# Altium schematic sheet main.SchDoc
size A3; SheetNumber: 1; SheetTotal: 1
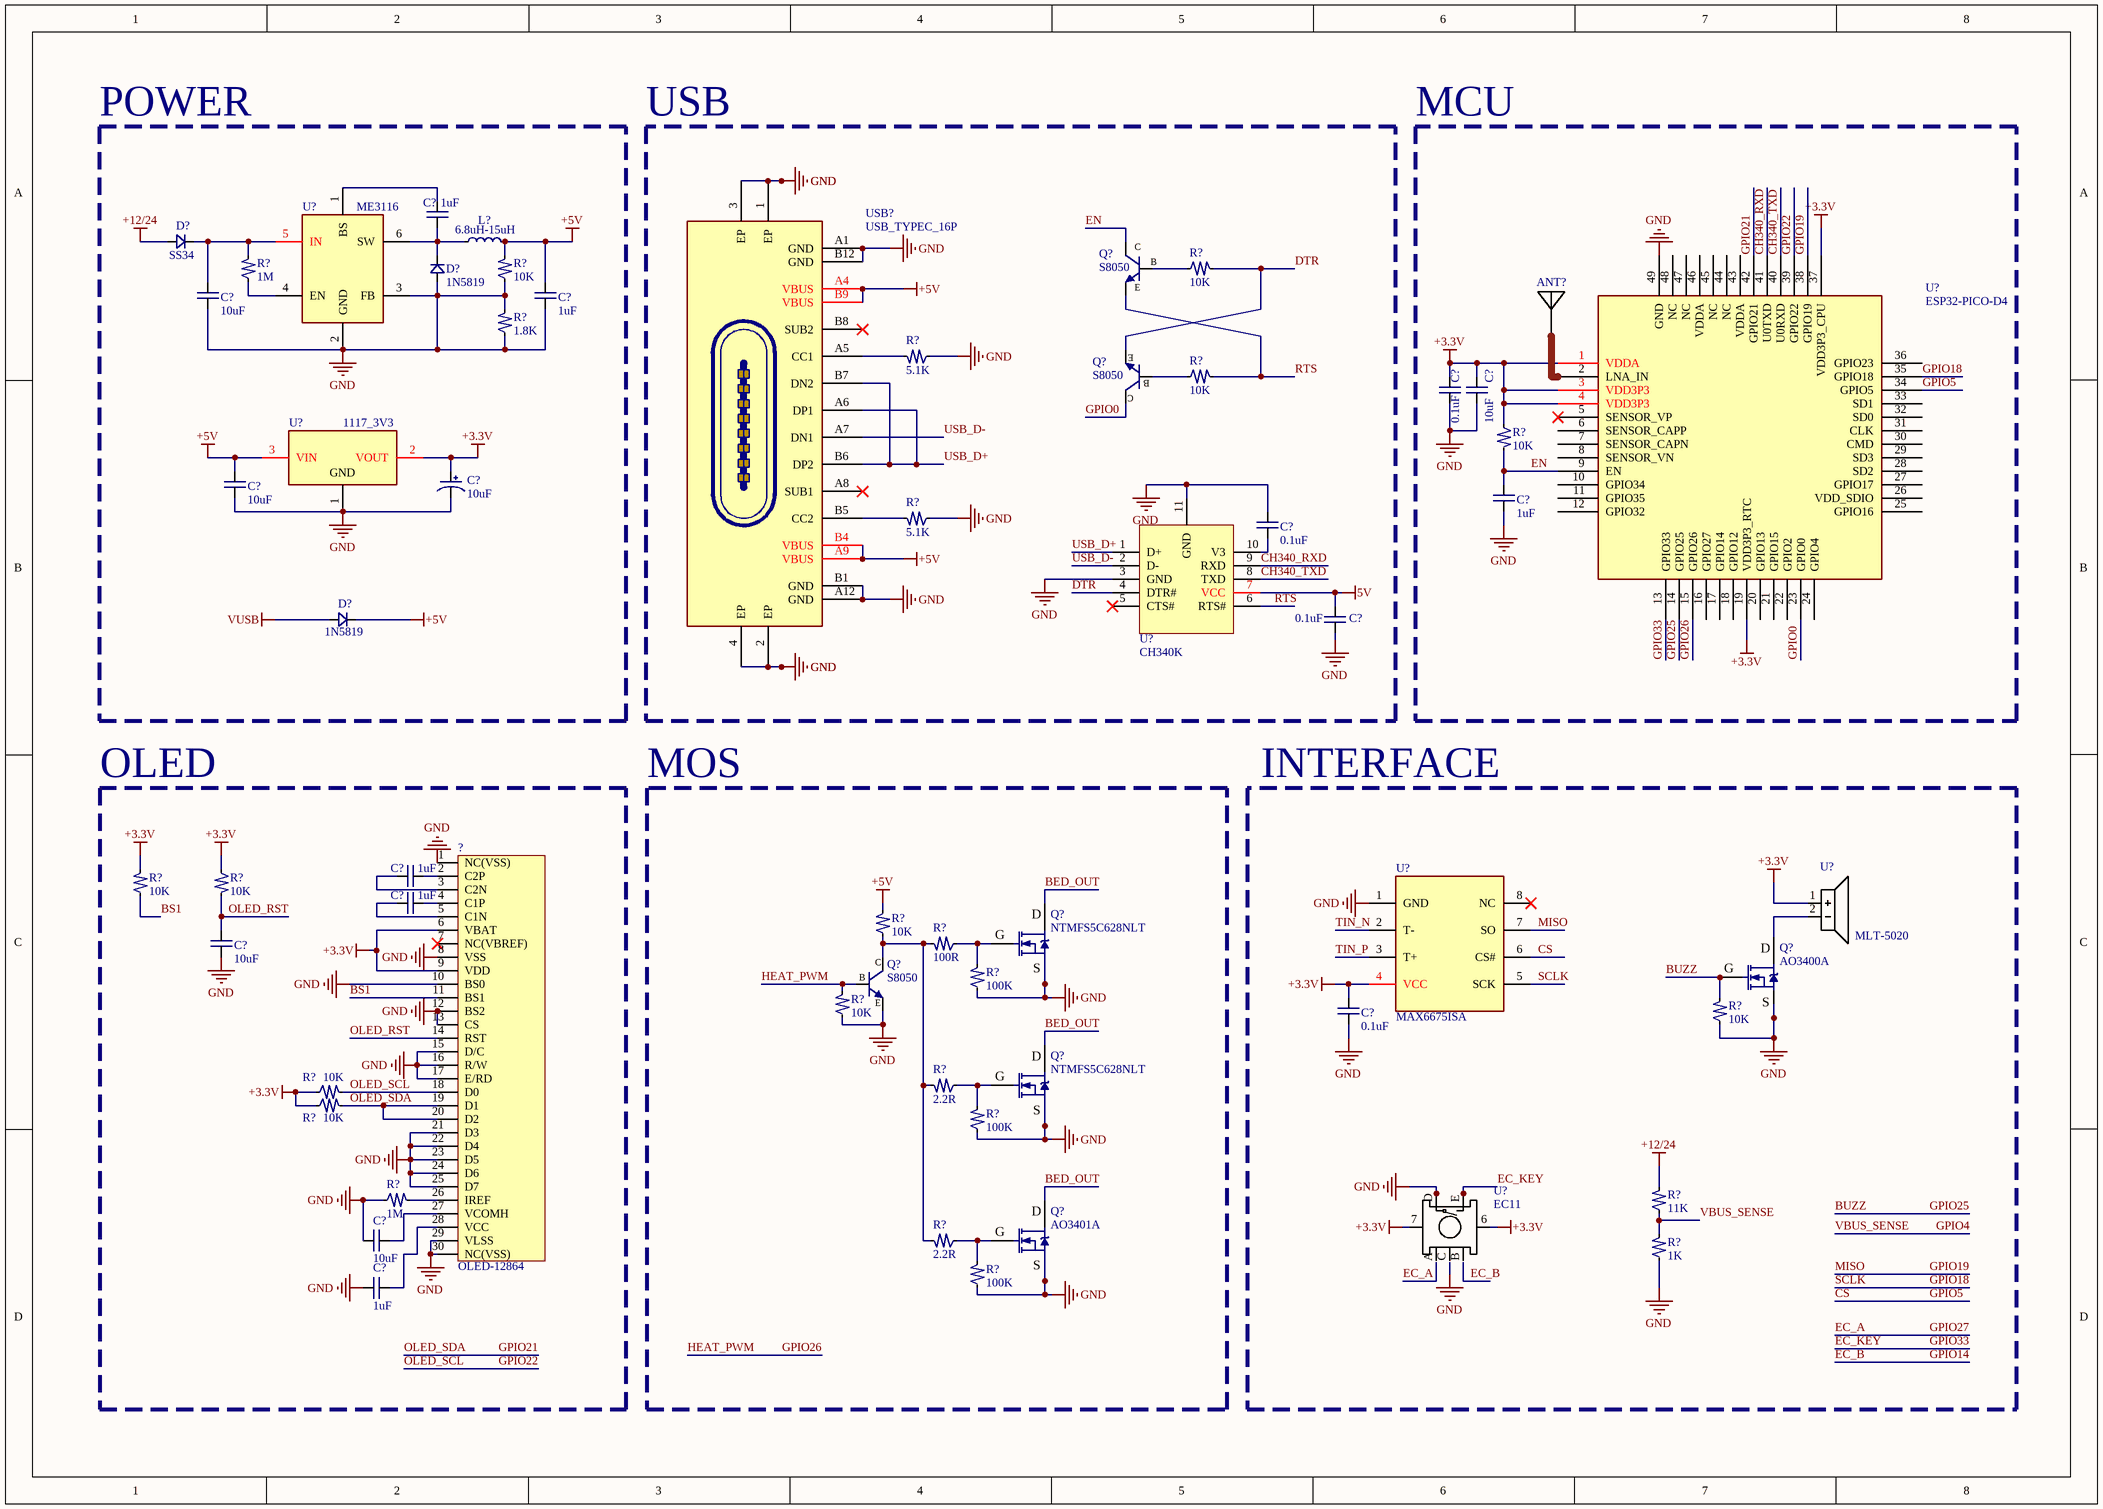
[diagram p0: main.SchDoc]

## Parts
(Parts that share a designator on the sheet are numbered #1, #2 ... from top to bottom, then left to right.)
?  OLED-12864  [OLED-12864-1.3-TOP]
ANT?  ANT  [CrossAir_CAC03]  (value not drawn)
C?#1  1uF
C?#2  10uF
C?#3  1uF
C?#4  0.1uF  [C_0603]
C?#5  10uF  [C_0603]
C?#6  10uF
C?#7  10uF  [CASE-A-3216]
C?#8  1uF  [C_0402]
C?#9  0.1uF  [C_0603]
C?#10  0.1uF  [C_0603]
C?#11  1uF
C?#12  1uF
C?#13  10uF
C?#14  0.1uF  [C_0603]
C?#15  10uF
C?#16  1uF
D?#1  SS34  [SMA(DO-214AC)]
D?#2  1N5819  [SMA(DO-214AC)]
D?#3  1N5819  [SMA(DO-214AC)]
L?  6.8uH-15uH
Q?#1  S8050  [SOT-23-3]
Q?#2  S8050  [SOT-23-3]
Q?#3  NTMFS5C628NLT
Q?#4  AO3400A
Q?#5  S8050  [SOT-23-3]
Q?#6  NTMFS5C628NLT
Q?#7  AO3401A
R?#1  1M  [R 0402_L]
R?#2  10K  [R 0402_L]
R?#3  10K  [R_0603]
R?#4  1.8K  [R 0402_L]
R?#5  5.1K  [R 0402_L]
R?#6  10K  [R_0603]
R?#7  10K  [R_0402]
R?#8  5.1K  [R 0402_L]
R?#9  10K  [R 0402_L]
R?#10  10K  [R 0402_L]
R?#11  10K  [R 0402_L]
R?#12  100R  [R 0402_L]
R?#13  100K  [R 0402_L]
R?#14  10K  [R 0402_L]
R?#15  10K  [R 0402_L]
R?#16  2.2R  [R 0402_L]
R?#17  10K  [R 0402_L]
R?#18  10K  [R 0402_L]
R?#19  100K  [R 0402_L]
R?#20  1M  [R 0402_L]
R?#21  11K  [R 0402_L]
R?#22  2.2R  [R 0402_L]
R?#23  1K  [R 0402_L]
R?#24  100K  [R 0402_L]
U?#1  ME3116
U?#2  ESP32-PICO-D4
U?#3  1117_3V3  [SOT-223]
U?#4  CH340K  [ESOP-10]
U?#5  MLT-5020
U?#6  MAX6675ISA
U?#7  EC11
USB?  USB_TYPEC_16P

## Blocks framed on the sheet
POWER: C?#1-C?#3 C?#6 C?#7 D?#1-D?#3 L? R?#1 R?#2 R?#4 U?#1 U?#3
USB: C?#9 C?#10 Q?#1 Q?#2 R?#3 R?#5 R?#6 R?#8 U?#4 USB?
MCU: ANT? C?#4 C?#5 C?#8 R?#7 U?#2
OLED: ? C?#11-C?#13 C?#15 C?#16 R?#9 R?#10 R?#17 R?#18 R?#20
MOS: Q?#3 Q?#5-Q?#7 R?#11-R?#14 R?#16 R?#19 R?#22 R?#24
INTERFACE: C?#14 Q?#4 R?#15 R?#21 R?#23 U?#5-U?#7

## Nets
5V: C?#10.2 U?#4.7(VCC)
+3.3V: ?.6(VBAT) ?.9(VDD) C?#4.1 C?#5.1 C?#7.1 C?#14.2 R?#7.2 R?#9.1 R?#10.2 R?#17.2 R?#18.2 U?#2.1(VDDA) U?#2.3(VDD3P3) U?#2.4(VDD3P3) U?#2.19(VDD3P3_RTC) U?#2.37(VDD3P3_CPU) U?#3.2(VOUT) U?#5.1 U?#6.4(VCC) U?#7.6 U?#7.7
+5V: C?#3.1 C?#6.1 D?#3.1 L?.1 R?#2.1 R?#11.1 U?#3.3(VIN) USB?.A4(VBUS) USB?.A9(VBUS) USB?.B4(VBUS) USB?.B9(VBUS)
+12/24: D?#1.2 R?#21.1
GND: ?.1(NC(VSS)) ?.8(VSS) ?.10(BS0) ?.12(BS2) ?.13(CS) ?.15(D/C) ?.16(R/W) ?.17(E/RD) ?.21(D3) ?.22(D4) ?.23(D5) ?.24(D6) ?.25(D7) ?.29(VLSS) ?.30(NC(VSS)) C?#2.2 C?#3.2 C?#4.2 C?#5.2 C?#6.2 C?#7.2 C?#8.1 C?#9.1 C?#10.1 C?#13.2 C?#14.1 C?#15.1 C?#16.1 D?#2.2 Q?#3.3(S) Q?#4.3(S) Q?#5.2(E) Q?#6.3(S) Q?#7.3(S) R?#2.2 R?#4.1 R?#4.2 R?#5.2 R?#8.2 R?#13.2 R?#14.2 R?#15.2 R?#19.2 R?#20.2 R?#23.2 R?#24.2 U?#1.2(GND) U?#1.3(FB) U?#2.49(GND) U?#3.1(GND) U?#4.3(GND) U?#4.11(GND) U?#6.1(GND) U?#7.D USB?.1(EP) USB?.2(EP) USB?.3(EP) USB?.4(EP) USB?.A1(GND) USB?.A12(GND) USB?.B1(GND) USB?.B12(GND)
VUSB: D?#3.2
BED_OUT: Q?#3.2(D) Q?#6.2(D) Q?#7.2(D)
BS1: ?.11(BS1) R?#9.2
BUZZ: Q?#4.1(G) R?#15.1 U?#2.14(GPIO25)  [also labelled GPIO25]
CH340_RXD: U?#2.41(U0TXD) U?#4.9(RXD)
CH340_TXD: U?#2.40(U0RXD) U?#4.8(TXD)
CS: U?#2.34(GPIO5) U?#6.6(CS#)  [also labelled GPIO5]
DTR: Q?#2.2(E) R?#3.1 U?#4.4(DTR#)
EC_KEY: U?#2.13(GPIO33) U?#7.E  [also labelled GPIO33]
EN: C?#8.2 Q?#1.3(C) R?#7.1 U?#2.9(EN)
GPIO0: Q?#2.3(C) U?#2.23(GPIO0)
GPIO4: R?#21.2 R?#23.1  [also labelled VBUS_SENSE]
GPIO18: U?#2.35(GPIO18) U?#6.5(SCK)  [also labelled SCLK]
GPIO19: U?#2.38(GPIO19) U?#6.7(SO)  [also labelled MISO]
GPIO21: ?.19(D1) ?.20(D2) R?#18.1 U?#2.42(GPIO21)  [also labelled OLED_SDA]
GPIO22: ?.18(D0) R?#17.1 U?#2.39(GPIO22)  [also labelled OLED_SCL]
GPIO26: Q?#5.1(B) R?#14.1 U?#2.15(GPIO26)  [also labelled HEAT_PWM]
OLED_RST: ?.14(RST) C?#13.1 R?#10.1
RTS: Q?#1.2(E) R?#6.1 U?#4.6(RTS#)
TIN_N: U?#6.2(T-)
TIN_P: U?#6.3(T+)
USB_D+: U?#4.1(D+) USB?.A6(DP1) USB?.B6(DP2) USB?.B7(DN2)
USB_D-: U?#4.2(D-) USB?.A7(DN1)
Net?_2: ?.2(C2P) C?#11.1
Net?_3: ?.3(C2N) C?#11.2
Net?_4: ?.4(C1P) C?#12.1
Net?_5: ?.5(C1N) C?#12.2
Net?_26: ?.26(IREF) R?#20.1
Net?_27: ?.27(VCOMH) C?#15.2
Net?_28: ?.28(VCC) C?#16.2
NetANT?_1: ANT?.1(Feed) U?#2.2(LNA_IN)
NetC?#1_1: C?#1.1 U?#1.1(BS)
NetC?#1_2: C?#1.2 D?#2.1 L?.2 U?#1.6(SW)
NetC?#2_1: C?#2.1 D?#1.1 R?#1.1 U?#1.5(IN)
NetC?#9_2: C?#9.2 U?#4.10(V3)
NetQ?#1_1: Q?#1.1(B) R?#3.2
NetQ?#2_1: Q?#2.1(B) R?#6.2
NetQ?#3_1: Q?#3.1(G) R?#12.2 R?#13.1
NetQ?#4_2: Q?#4.2(D) U?#5.2
NetQ?#5_3: Q?#5.3(C) R?#11.2 R?#12.1 R?#16.1 R?#22.1
NetQ?#6_1: Q?#6.1(G) R?#16.2 R?#19.1
NetQ?#7_1: Q?#7.1(G) R?#22.2 R?#24.1
NetR?#1_2: R?#1.2 U?#1.4(EN)
NetR?#5_1: R?#5.1 USB?.A5(CC1)
NetR?#8_1: R?#8.1 USB?.B5(CC2)

Not connected (* = marked no-connect by the designer): ? 7(NC(VBREF))*; U?#2 5(SENSOR_VP)* 6(SENSOR_CAPP) 7(SENSOR_CAPN) 8(SENSOR_VN) 10(GPIO34) 11(GPIO35) 12(GPIO32) 16(GPIO27) 17(GPIO14) 18(GPIO12) 20(GPIO13) 21(GPIO15) 22(GPIO2) 24(GPIO4) 25(GPIO16) 26(VDD_SDIO) 27(GPIO17) 28(SD2) 29(SD3) 30(CMD) 31(CLK) 32(SD0) 33(SD1) 36(GPIO23) 43(VDDA) 44(NC) 45(NC) 46(VDDA) 47(NC) 48(NC); U?#4 5(CTS#)*; U?#6 8(NC)*; U?#7 A B C; USB? A8(SUB1)* B8(SUB2)*

## Library data of the parts
? = OLED-12864: 显示屏
ANT? = ANT: 天线
C?#1-C?#6 C?#8-C?#16 = C: 无极性电容
C?#7 = C_P: 极性电容
D?#1 = D: 二极管
D?#2 D?#3 = D: 肖特基二极管
L? = L: 电感
Q?#1 Q?#2 Q?#5 = NFET: 三极管
Q?#3 Q?#4 Q?#6 Q?#7 = NMOS
R?#1-R?#24 = R: 电阻
U?#1 = ME3116: DCDC,BUCK,40V
U?#2 = ESP32-PICO
U?#3 = 1117_3V3: LDO to 3V3
U?#4 = CH340K: UART-TTL
U?#5 = BUZZ: 无源蜂鸣器
U?#7 = EC11: 旋转编码器
USB? = USB_TYPEC_16P: USB母座，TYPEC，16P